# Altium schematic sheet 36. PCIe_M.2_INTERFACE SDIO.SchDoc: PCIe_M.2_INTERFACE (E Key)
size 513 x 386 mm; Project: PROC154E2(001)_SK_AM69; Issue: 1.0; RevCode: E3; Page Create Date: March  8, 1995; Variant Name: Core Design; Schematic Page Number: 36; Page Number: 36; Page Size: C; Comment: MISTRAL_TITLEBLK_CSIZE_1; Page Count: 62; Schematic Page Count: 62; Name: PROC154E2 001 SK AM69; DsnPath: C:\Users\danie\Downloads\sprr466c\PROC154E3_RP\PROC154E3_SCH.DSN; SchematicName: SCHEMATIC1; PageName: 36. PCIe_M.2_INTERFACE SDIO; PageSize: C; TopSchematic: True
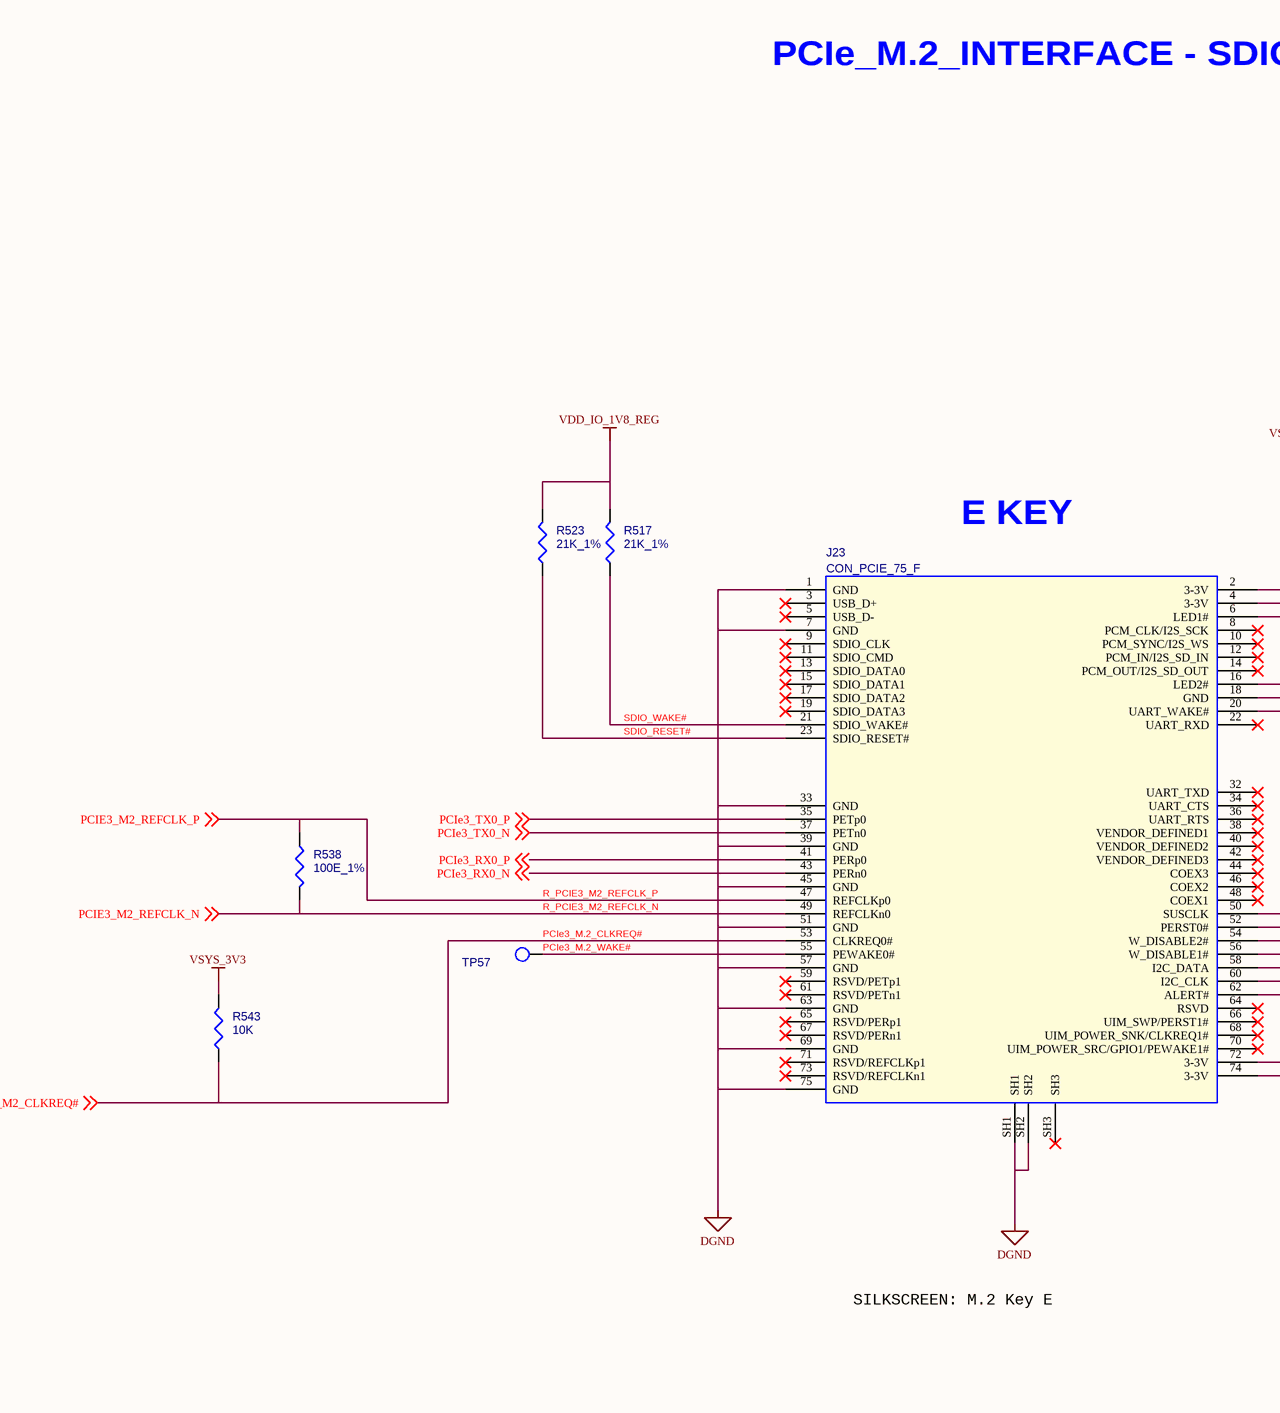
[diagram p0: 36. PCIe_M.2_INTERFACE SDIO.SchDoc, left]
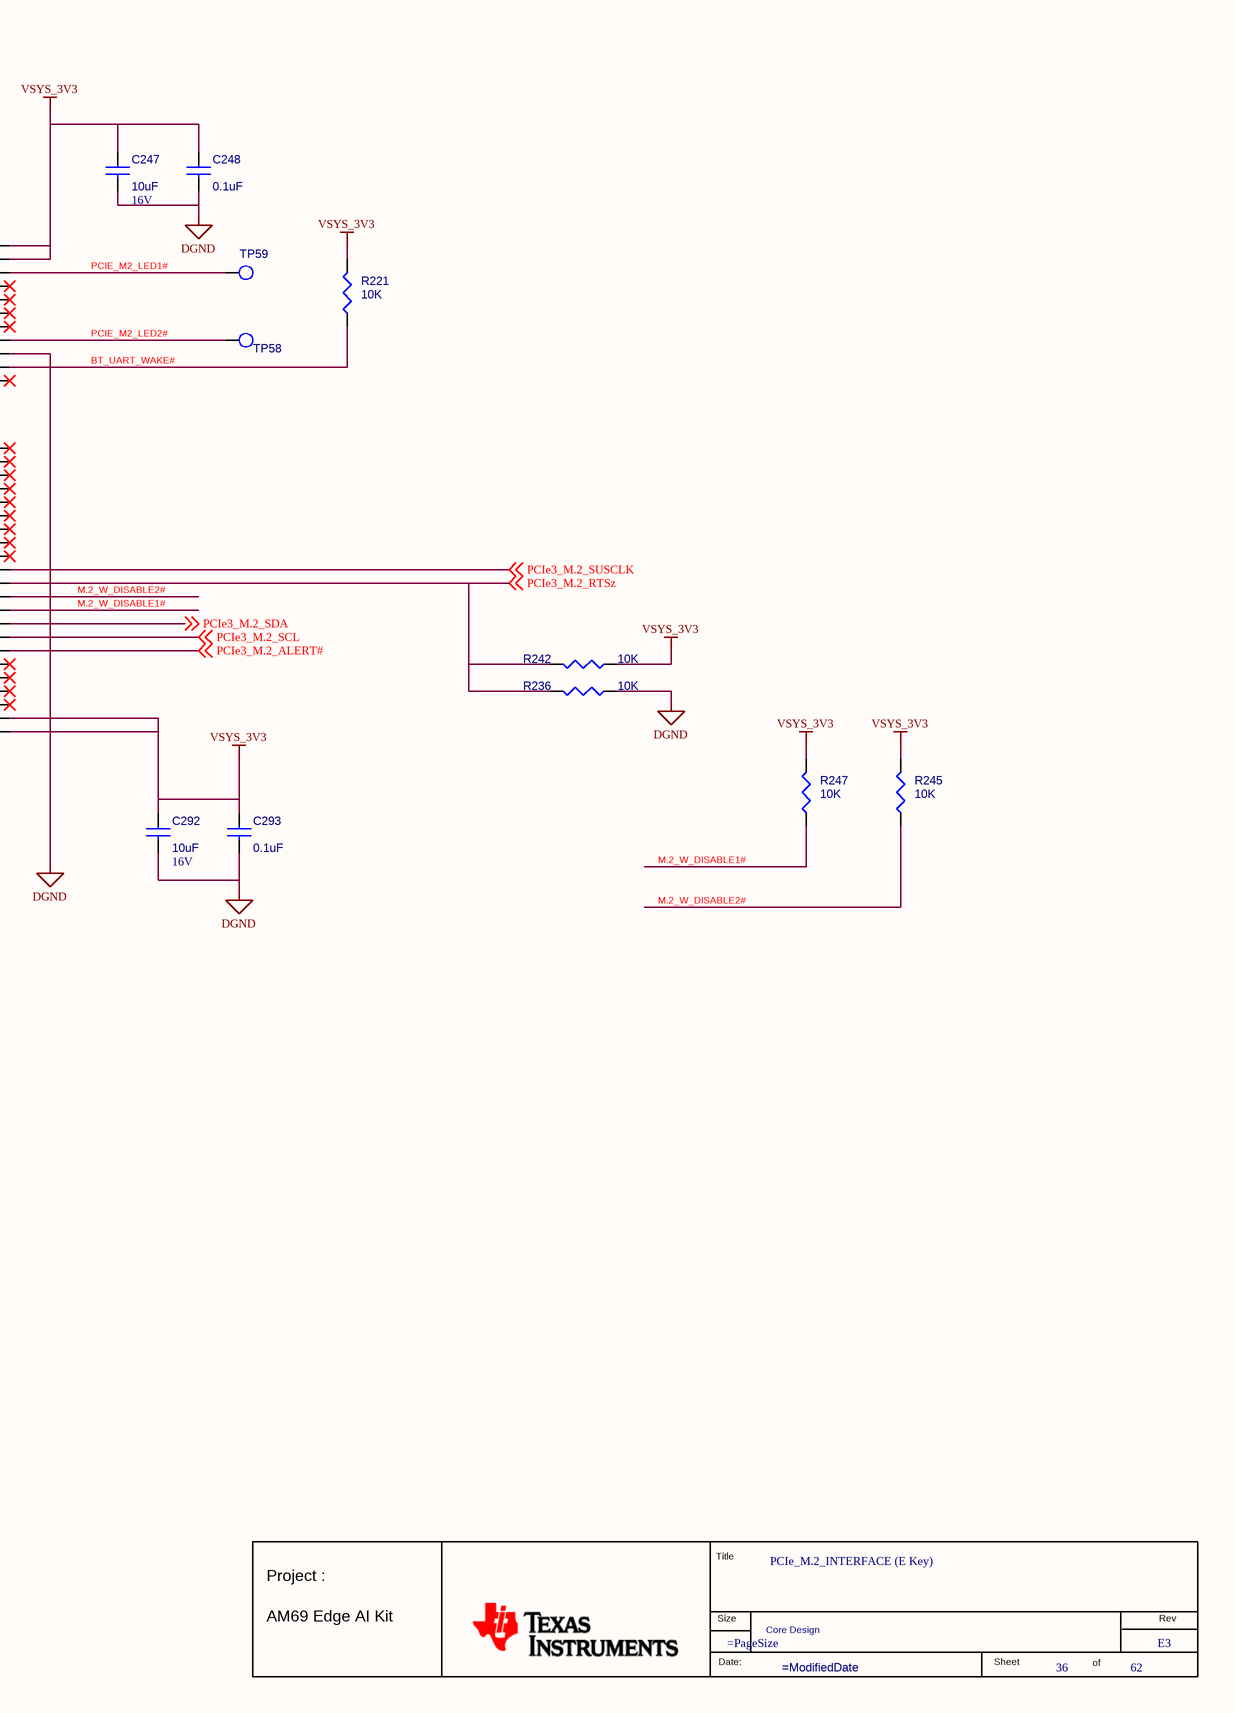
[diagram p1: 36. PCIe_M.2_INTERFACE SDIO.SchDoc, right]

## Parts
*  RevCode: E3  Title: PCIe_M.2_INTERFACE (E Key)  Page Number: 36  Page Count: 62  Variant Name: Core Design  (hidden comment: MISTRAL_TITLEBLK_CSIZE_1)  (graphical)
C247  10uF  Voltage: 16V  [CAP0603_1]
C248  0.1uF  [CAP0201_0-5]
C292  10uF  Voltage: 16V  [CAP0603_1]
C293  0.1uF  [CAP0201_0-5]
J23  CON_PCIE_75_F  [CON_PCIE75_MDT320E01001_S_R_S_3-2_2230]
R221  10K  [RES0201_0-5]
R236  10K  [RES0402_0-5]
R242  10K  [RES0402_0-5]
R245  10K  [RES0201_0-5]
R247  10K  [RES0201_0-5]
R517  21K_1%  [RES0201_0-5]
R523  21K_1%  [RES0201_0-5]
R538  100E_1%  [RES0402_0-5]
R543  10K  [RES0201_0-5]
TP57  TP30_SMD  [TP30_SMD]  (value not drawn)
TP58  TP30_SMD  [TP30_SMD]  (value not drawn)
TP59  TP30_SMD  [TP30_SMD]  (value not drawn)

## Nets
DGND: C247.2 C248.2 C292.2 C293.2 J23.1(GND) J23.7(GND) J23.18(GND) J23.33(GND) J23.39(GND) J23.45(GND) J23.51(GND) J23.57(GND) J23.63(GND) J23.69(GND) J23.75(GND) J23.SH1 J23.SH2 R236.1
VDD_IO_1V8_REG: R517.2 R523.2
VSYS_3V3: C247.1 C248.1 C292.1 C293.1 J23.2(3-3V) J23.4(3-3V) J23.72(3-3V) J23.74(3-3V) R221.2 R242.1 R245.2 R247.2 R543.2
BT_UART_WAKE#: J23.20(UART_WAKE#) R221.1
M.2_W_DISABLE1#: J23.56(W_DISABLE1#) R247.1
M.2_W_DISABLE2#: J23.54(W_DISABLE2#) R245.1
PCIe3_M.2_ALERT#: J23.62(ALERT#) ; off-sheet PCIe3_M.2_ALERT#
PCIe3_M.2_CLKREQ#: J23.53(CLKREQ0#) R543.1 ; off-sheet PCIe3_M2_CLKREQ#  [also labelled PCIe3_M2_CLKREQ#]
PCIe3_M.2_RTSz: J23.52(PERST0#) R236.2 R242.2 ; off-sheet PCIe3_M.2_RTSz
PCIe3_M.2_SCL: J23.60(I2C_CLK) ; off-sheet PCIe3_M.2_SCL
PCIe3_M.2_SDA: J23.58(I2C_DATA) ; off-sheet PCIe3_M.2_SDA
PCIe3_M.2_SUSCLK: J23.50(SUSCLK) ; off-sheet PCIe3_M.2_SUSCLK
PCIe3_M.2_WAKE#: J23.55(PEWAKE0#) TP57.1(TP)
PCIe3_RX0_N: J23.43(PERn0) ; off-sheet PCIe3_RX0_N
PCIe3_RX0_P: J23.41(PERp0) ; off-sheet PCIe3_RX0_P
PCIe3_TX0_N: J23.37(PETn0) ; off-sheet PCIe3_TX0_N
PCIe3_TX0_P: J23.35(PETp0) ; off-sheet PCIe3_TX0_P
PCIE_M2_LED1#: J23.6(LED1#) TP59.1(TP)
PCIE_M2_LED2#: J23.16(LED2#) TP58.1(TP)
R_PCIE3_M2_REFCLK_N: J23.49(REFCLKn0) R538.1 ; off-sheet PCIE3_M2_REFCLK_N  [also labelled PCIE3_M2_REFCLK_N]
R_PCIE3_M2_REFCLK_P: J23.47(REFCLKp0) R538.2 ; off-sheet PCIE3_M2_REFCLK_P  [also labelled PCIE3_M2_REFCLK_P]
SDIO_RESET#: J23.23(SDIO_RESET#) R523.1
SDIO_WAKE#: J23.21(SDIO_WAKE#) R517.1

Not connected (* = marked no-connect by the designer): J23 3(USB_D+)* 5(USB_D-)* 8(PCM_CLK/I2S_SCK)* 9(SDIO_CLK)* 10(PCM_SYNC/I2S_WS)* 11(SDIO_CMD)* 12(PCM_IN/I2S_SD_IN)* 13(SDIO_DATA0)* 14(PCM_OUT/I2S_SD_OUT)* 15(SDIO_DATA1)* 17(SDIO_DATA2)* 19(SDIO_DATA3)* 22(UART_RXD)* 32(UART_TXD)* 34(UART_CTS)* 36(UART_RTS)* 38(VENDOR_DEFINED1)* 40(VENDOR_DEFINED2)* 42(VENDOR_DEFINED3)* 44(COEX3)* 46(COEX2)* 48(COEX1)* 59(RSVD/PETp1)* 61(RSVD/PETn1)* 64(RSVD)* 65(RSVD/PERp1)* 66(UIM_SWP/PERST1#)* 67(RSVD/PERn1)* 68(UIM_POWER_SNK/CLKREQ1#)* 70(UIM_POWER_SRC/GPIO1/PEWAKE1#)* 71(RSVD/REFCLKp1)* 73(RSVD/REFCLKn1)* SH3*

## Notes on the sheet
- PCIe_M.2_INTERFACE - SDIO
- E KEY
- SILKSCREEN: M.2 Key E
- (in symbol MISTRAL_TITLEBLK_CSIZE_1) Title; Project :; Size; Rev; AM69 Edge AI Kit; Date:; Sheet; of

## Library data of the parts
* = MISTRAL_TITLEBLK_CSIZE_1: Issue: 1.0; Project: PROC154E2(001)_SK_AM69; Name: PROC154E2 001 SK AM69; Page Create Date: March  8, 1995; Page Size: =PageSize; Page Modify Date: =ModifiedDate; Schematic Page Count: 62; Schematic Page Number: 36
C247 = CAP_Dup1: CAP CERAMIC 10uF 16V 20% X6S AUTO 0603; Part Reference: C247; Part_type: CAPACITORS\CERAMIC; Mfr_part_number: GRT188C81C106ME13D; Mfr_name: MURATA; Mistral Part No: 120020090012-R; Direct Alternate_mfr_name: TDK; Direct Alternate_mfr_part_number: C1608X5R1E106M080AC; Automotive Alternate_mfr_part_number: GRT188R61E106ME13D; Custom_Duty: 15%; Customs_HS_Code: 85322990; Wattage: NA; Project: J7VCL_SOM_LEO_HERA_PMIC_BRD; Value: 10uF; MECHANICAL 3D STEP FILE: CAP0603_1; Chkd/date: MANIRAJA/180920; Crtd /date: ALVY/170920; Datasheet: Y:\MIS_DATABASE\DATASHEETS\CAPACITORS\GRT188C81C106ME13.PDF; Temperature: -55°C+105°C; Weight: 2mg; Height: 1.00MM; Distributor_part_number: 490-12286-1-ND; Distributor_name: DIGIKEY; Package: 0603; Tolerance: 20%; Library Ref: CAP; Footprint Ref: CAP0603_1; Library Path: Y:\MIS_DATABASE\Library\ALTIUM_TOOL\SCHEMATICS_PARTS\MS_DISCRETE_Library.schlib; Footprint Path: Y:\MIS_DATABASE\Library\ALTIUM_TOOL\PCB_FOOTPRINTS\Altium_Footprint_Lib.PcbLib; Automotive Alternate_mfr_name: MURATA; PCB Footprint: CAP0603_1
C248 = CAP_Dup1: CAP CERAMIC 0.1uF 16V 10% X7S AUTO 0201; Part Reference: C248; Part_type: CAPACITORS\CERAMIC; Mfr_part_number: GRT033C71C104KE01D; Mfr_name: MURATA; Mistral Part No: 120021030007-R; Custom_Duty: 15%; Customs_HS_Code: 85322990; Wattage: NA; Project: J7ES_SK_BRD; Value: 0.1uF; MECHANICAL 3D STEP FILE: CAP0201_0-5; Chkd/date: MANIRAJA/110321; Crtd /date: ALVY/110321; Datasheet: Y:\MIS_DATABASE\DATASHEETS\CAPACITORS\GRT033C71C104KE01.PDF; Temperature: -55°C+125°C; Weight: 330mg; Height: 0.33MM; Distributor_part_number: 490-GRT033C71C104KE01DTR-ND; Distributor_name: DIGIKEY; Package: 0201; Voltage: 16V; Tolerance: 10%; PCB Footprint: CAP0201_0-5
C292 = CAP_Dup1: CAP CERAMIC 10uF 16V 20% X6S AUTO 0603; Part Reference: C292; Part_type: CAPACITORS\CERAMIC; Mfr_part_number: GRT188C81C106ME13D; Mfr_name: MURATA; Mistral Part No: 120020090012-R; Direct Alternate_mfr_name: TDK; Direct Alternate_mfr_part_number: C1608X5R1E106M080AC; Automotive Alternate_mfr_part_number: GRT188R61E106ME13D; Custom_Duty: 15%; Customs_HS_Code: 85322990; Wattage: NA; Project: J7VCL_SOM_LEO_HERA_PMIC_BRD; Value: 10uF; MECHANICAL 3D STEP FILE: CAP0603_1; Chkd/date: MANIRAJA/180920; Crtd /date: ALVY/170920; Datasheet: Y:\MIS_DATABASE\DATASHEETS\CAPACITORS\GRT188C81C106ME13.PDF; Temperature: -55°C+105°C; Weight: 2mg; Height: 1.00MM; Distributor_part_number: 490-12286-1-ND; Distributor_name: DIGIKEY; Package: 0603; Tolerance: 20%; Library Ref: CAP; Footprint Ref: CAP0603_1; Library Path: Y:\MIS_DATABASE\Library\ALTIUM_TOOL\SCHEMATICS_PARTS\MS_DISCRETE_Library.schlib; Footprint Path: Y:\MIS_DATABASE\Library\ALTIUM_TOOL\PCB_FOOTPRINTS\Altium_Footprint_Lib.PcbLib; Automotive Alternate_mfr_name: MURATA; PCB Footprint: CAP0603_1
C293 = CAP_Dup1: CAP CERAMIC 0.1uF 16V 10% X7S AUTO 0201; Part Reference: C293; Mistral Part No: 120021030007-R; Mfr_name: MURATA; Mfr_part_number: GRT033C71C104KE01D; Part_type: CAPACITORS\CERAMIC; Project: J7ES_SK_BRD; Wattage: NA; Customs_HS_Code: 85322990; Custom_Duty: 15%; Value: 0.1uF; Tolerance: 10%; Voltage: 16V; Package: 0201; Distributor_name: DIGIKEY; Distributor_part_number: 490-GRT033C71C104KE01DTR-ND; Height: 0.33MM; Weight: 330mg; Temperature: -55°C+125°C; Datasheet: Y:\MIS_DATABASE\DATASHEETS\CAPACITORS\GRT033C71C104KE01.PDF; Crtd /date: ALVY/110321; Chkd/date: MANIRAJA/110321; MECHANICAL 3D STEP FILE: CAP0201_0-5; PCB Footprint: CAP0201_0-5
J23 = CON_PCI_75_MDT320E01001_2230: CON PCI EXPRESS 75POS 0.50MM PITCH FEMALE RT SMD; Part Reference: J23; Part_type: CONNECTOR\PCI; Mfr_name: AMPHENOL; Mistral Part No: 150021020005-R; Custom_Duty: 24%; Customs_HS_Code: 85369090; Wattage: NA; Project: J7ES_SK_BRD; Value: CON_PCIE_75_F; Footprint Path: Y:\MIS_DATABASE\Library\ALTIUM_TOOL\PCB_FOOTPRINTS\Altium_Footprint_Lib.PcbLib; Library Path: Y:\MIS_DATABASE\Library\ALTIUM_TOOL\SCHEMATICS_PARTS\MS_CONNECTOR_Library.schlib; MECHANICAL 3D STEP FILE: CON_PCIE75_MDT320E01001_S_R_S_3-2_2230; Chkd/date: ALVY/040221; Crtd /date: MANIRAJA/030221; Datasheet: Y:\MIS_DATABASE\DATASHEETS\CONNECTORS\MDTXXXX001.PDF; Temperature: -40°C+80°C; Weight: NA; Height: 3.20MM; Library Ref: CON_PCI_75_MDT320E01001_2230; Distributor_part_number: MDT320E01001CT-ND; Distributor_name: DIGIKEY; Package: SMD; Voltage: NA; Tolerance: NA; Mfr_part_number: MDT320E01001_2230; Footprint Ref: CON_PCIE75_MDT320E01001_S_R_S_3-2_2230; PCB Footprint: CON_PCIE75_MDT320E01001_S_R_S_3-2_2230
R221 = RESISTOR_Dup2: RES 10K 1/20W 5% 0201; Part Reference: R221; Part_type: RESISTORS\FIXED; Mfr_part_number: RC0201JR-0710KL; Mfr_name: YAGEO AMERICA; Mistral Part No: 110010070051-R; Custom_Duty: 15%; Customs_HS_Code: 85332119; Voltage: NA; Project: GOLDEN-I LITE; Value: 10K; MECHANICAL 3D STEP FILE: RES0201_0-5; Chkd/date: MANIRAJA/050517; Crtd /date: MANIRAJA/050517; Datasheet: Y:\MIS_DATABASE\DATASHEETS\RESISTORS\RCXXXXL-SER_MAR18.PDF; Temperature: -55°C+125°C; Weight: 0.17mg; Height: 0.26MM; Distributor_part_number: 311-10KNCT-ND; Distributor_name: DIGIKEY; Package: 0201; Wattage: 1/20W; Tolerance: 5%; Library Ref: RESISTOR; Footprint Ref: RES0201_0-5; Library Path: Y:\MIS_DATABASE\Library\ALTIUM_TOOL\SCHEMATICS_PARTS\MS_DISCRETE_Library.schlib; Footprint Path: Y:\MIS_DATABASE\Library\ALTIUM_TOOL\PCB_FOOTPRINTS\Altium_Footprint_Lib.PcbLib; PCB Footprint: RES0201_0-5
R236 = RESISTOR_Dup2: RES 10K 1/16W 5% 0402; Part Reference: R236; Part_type: RESISTORS\FIXED; Mfr_part_number: RC0402JR-0710KL; Mfr_name: YAGEO AMERICA; Mistral Part No: 110011060021-R; Custom_Duty: 15%; Customs_HS_Code: 85332119; Voltage: NA; Project: HSE; Value: 10K; MECHANICAL 3D STEP FILE: RES0402_0-5; Chkd/date: VASANTHA/061216; Crtd /date: MAZHAR/230805; Datasheet: Y:\MIS_DATABASE\DATASHEETS\RESISTORS\RCXXXXL-SER_MAR18.PDF; Temperature: -55°C+155°C; Weight: 0.65mg; Height: 0.40MM; Distributor_part_number: 311-10KJRCT-ND; Distributor_name: DIGIKEY; Package: 0402; Wattage: 1/16W; Tolerance: 5%; Library Ref: RESISTOR; Footprint Ref: RES0402_0-5; Library Path: Y:\MIS_DATABASE\Library\ALTIUM_TOOL\SCHEMATICS_PARTS\MS_DISCRETE_Library.schlib; Footprint Path: Y:\MIS_DATABASE\Library\ALTIUM_TOOL\PCB_FOOTPRINTS\Altium_Footprint_Lib.PcbLib; PCB Footprint: RES0402_0-5
R242 = RESISTOR_Dup2: RES 10K 1/16W 5% 0402; Part Reference: R242; Part_type: RESISTORS\FIXED; Mfr_part_number: RC0402JR-0710KL; Mfr_name: YAGEO AMERICA; Mistral Part No: 110011060021-R; Custom_Duty: 15%; Customs_HS_Code: 85332119; Voltage: NA; Project: HSE; Value: 10K; MECHANICAL 3D STEP FILE: RES0402_0-5; Chkd/date: VASANTHA/061216; Crtd /date: MAZHAR/230805; Datasheet: Y:\MIS_DATABASE\DATASHEETS\RESISTORS\RCXXXXL-SER_MAR18.PDF; Temperature: -55°C+155°C; Weight: 0.65mg; Height: 0.40MM; Distributor_part_number: 311-10KJRCT-ND; Distributor_name: DIGIKEY; Package: 0402; Wattage: 1/16W; Tolerance: 5%; Library Ref: RESISTOR; Footprint Ref: RES0402_0-5; Library Path: Y:\MIS_DATABASE\Library\ALTIUM_TOOL\SCHEMATICS_PARTS\MS_DISCRETE_Library.schlib; Footprint Path: Y:\MIS_DATABASE\Library\ALTIUM_TOOL\PCB_FOOTPRINTS\Altium_Footprint_Lib.PcbLib; PCB Footprint: RES0402_0-5
R245 = RESISTOR_Dup2: RES 10K 1/20W 5% 0201; Part Reference: R245; Part_type: RESISTORS\FIXED; Mfr_part_number: RC0201JR-0710KL; Mfr_name: YAGEO AMERICA; Mistral Part No: 110010070051-R; Custom_Duty: 15%; Customs_HS_Code: 85332119; Voltage: NA; Project: GOLDEN-I LITE; Value: 10K; MECHANICAL 3D STEP FILE: RES0201_0-5; Chkd/date: MANIRAJA/050517; Crtd /date: MANIRAJA/050517; Datasheet: Y:\MIS_DATABASE\DATASHEETS\RESISTORS\RCXXXXL-SER_MAR18.PDF; Temperature: -55°C+125°C; Weight: 0.17mg; Height: 0.26MM; Distributor_part_number: 311-10KNCT-ND; Distributor_name: DIGIKEY; Package: 0201; Wattage: 1/20W; Tolerance: 5%; Library Ref: RESISTOR; Footprint Ref: RES0201_0-5; Library Path: Y:\MIS_DATABASE\Library\ALTIUM_TOOL\SCHEMATICS_PARTS\MS_DISCRETE_Library.schlib; Footprint Path: Y:\MIS_DATABASE\Library\ALTIUM_TOOL\PCB_FOOTPRINTS\Altium_Footprint_Lib.PcbLib; PCB Footprint: RES0201_0-5
R247 = RESISTOR_Dup2: RES 10K 1/20W 5% 0201; Part Reference: R247; Part_type: RESISTORS\FIXED; Mfr_part_number: RC0201JR-0710KL; Mfr_name: YAGEO AMERICA; Mistral Part No: 110010070051-R; Custom_Duty: 15%; Customs_HS_Code: 85332119; Voltage: NA; Project: GOLDEN-I LITE; Value: 10K; MECHANICAL 3D STEP FILE: RES0201_0-5; Chkd/date: MANIRAJA/050517; Crtd /date: MANIRAJA/050517; Datasheet: Y:\MIS_DATABASE\DATASHEETS\RESISTORS\RCXXXXL-SER_MAR18.PDF; Temperature: -55°C+125°C; Weight: 0.17mg; Height: 0.26MM; Distributor_part_number: 311-10KNCT-ND; Distributor_name: DIGIKEY; Package: 0201; Wattage: 1/20W; Tolerance: 5%; Library Ref: RESISTOR; Footprint Ref: RES0201_0-5; Library Path: Y:\MIS_DATABASE\Library\ALTIUM_TOOL\SCHEMATICS_PARTS\MS_DISCRETE_Library.schlib; Footprint Path: Y:\MIS_DATABASE\Library\ALTIUM_TOOL\PCB_FOOTPRINTS\Altium_Footprint_Lib.PcbLib; PCB Footprint: RES0201_0-5
R517 = RESISTOR_Dup2: RES 21K 1/20W 1% 0201; Part Reference: R517; Part_type: RESISTORS\FIXED; Mfr_part_number: RC0201FR-0721KL; Mfr_name: YAGEO AMERICA; Mistral Part No: 110016110009-R; Custom_Duty: 15%; Customs_HS_Code: 85332119; Voltage: NA; Project: GOLDEN-I LITE; Value: 21K_1%; MECHANICAL 3D STEP FILE: RES0201_0-5; Chkd/date: MANIRAJA/030717; Crtd /date: MANIRAJA/030717; Datasheet: Y:\MIS_DATABASE\DATASHEETS\RESISTORS\RCXXXXL-SER_MAR18.PDF; Temperature: -55°C+125°C; Weight: 0.17mg; Height: 0.26MM; Distributor_part_number: YAG2506CT-ND; Distributor_name: DIGIKEY; Package: 0201; Wattage: 1/20W; Tolerance: 1%; Library Ref: RESISTOR; Footprint Ref: RES0201_0-5; Library Path: Y:\MIS_DATABASE\Library\ALTIUM_TOOL\SCHEMATICS_PARTS\MS_DISCRETE_Library.schlib; Footprint Path: Y:\MIS_DATABASE\Library\ALTIUM_TOOL\PCB_FOOTPRINTS\Altium_Footprint_Lib.PcbLib; PCB Footprint: RES0201_0-5
R523 = RESISTOR_Dup2: RES 21K 1/20W 1% 0201; Part Reference: R523; Mistral Part No: 110016110009-R; Mfr_name: YAGEO AMERICA; Mfr_part_number: RC0201FR-0721KL; Part_type: RESISTORS\FIXED; Project: GOLDEN-I LITE; Voltage: NA; Customs_HS_Code: 85332119; Custom_Duty: 15%; Value: 21K_1%; PCB Footprint: RES0201_0-5; Footprint Path: Y:\MIS_DATABASE\Library\ALTIUM_TOOL\PCB_FOOTPRINTS\Altium_Footprint_Lib.PcbLib; Library Path: Y:\MIS_DATABASE\Library\ALTIUM_TOOL\SCHEMATICS_PARTS\MS_DISCRETE_Library.schlib; Footprint Ref: RES0201_0-5; Library Ref: RESISTOR; Tolerance: 1%; Wattage: 1/20W; Package: 0201; Distributor_name: DIGIKEY; Distributor_part_number: YAG2506CT-ND; Height: 0.26MM; Weight: 0.17mg; Temperature: -55°C+125°C; Datasheet: Y:\MIS_DATABASE\DATASHEETS\RESISTORS\RCXXXXL-SER_MAR18.PDF; Crtd /date: MANIRAJA/030717; Chkd/date: MANIRAJA/030717; MECHANICAL 3D STEP FILE: RES0201_0-5
R538 = RESISTOR_Dup2: RES 100E 1/10W 1% 0402; Part Reference: R538; Part_type: RESISTORS\FIXED; Mfr_part_number: ERJ-2RKF1000X; Mfr_name: PANASONIC-ECG; Mistral Part No: 110018020036-R; Custom_Duty: 15%; Customs_HS_Code: 85332119; Voltage: NA; Project: CYPHY_FVB; Value: 100E_1%; Footprint Path: Y:\MIS_DATABASE\Library\ALTIUM_TOOL\PCB_FOOTPRINTS\Altium_Footprint_Lib.PcbLib; Library Path: Y:\MIS_DATABASE\Library\ALTIUM_TOOL\SCHEMATICS_PARTS\MS_DISCRETE_Library.schlib; Footprint Ref: RES0402_0-5; Library Ref: RESISTOR; Chkd/date: MANIRAJA/130617; Crtd /date: JEBRAN/040715; Datasheet: Y:\MIS_DATABASE\DATASHEETS\RESISTORS\PAN-ERJSER_NOV17.PDF; Temperature: -55°C+155°C; Weight: 0.8mg; Height: 0.40MM; Distributor_part_number: P100LCT-ND; Distributor_name: DIGIKEY; Package: 0402; Wattage: 1/10W; Tolerance: 1%; MECHANICAL 3D STEP FILE: RES0402_0-5; PCB Footprint: RES0402_0-5
R543 = RESISTOR_Dup2: RES 10K 1/20W 5% 0201; Part Reference: R543; Part_type: RESISTORS\FIXED; Mfr_part_number: RC0201JR-0710KL; Mfr_name: YAGEO AMERICA; Mistral Part No: 110010070051-R; Custom_Duty: 15%; Customs_HS_Code: 85332119; Voltage: NA; Project: GOLDEN-I LITE; Value: 10K; MECHANICAL 3D STEP FILE: RES0201_0-5; Chkd/date: MANIRAJA/050517; Crtd /date: MANIRAJA/050517; Datasheet: Y:\MIS_DATABASE\DATASHEETS\RESISTORS\RCXXXXL-SER_MAR18.PDF; Temperature: -55°C+125°C; Weight: 0.17mg; Height: 0.26MM; Distributor_part_number: 311-10KNCT-ND; Distributor_name: DIGIKEY; Package: 0201; Wattage: 1/20W; Tolerance: 5%; Library Ref: RESISTOR; Footprint Ref: RES0201_0-5; Library Path: Y:\MIS_DATABASE\Library\ALTIUM_TOOL\SCHEMATICS_PARTS\MS_DISCRETE_Library.schlib; Footprint Path: Y:\MIS_DATABASE\Library\ALTIUM_TOOL\PCB_FOOTPRINTS\Altium_Footprint_Lib.PcbLib; PCB Footprint: RES0201_0-5
TP57 = TESTPOINT_Dup1: TESTPOINT CIR 30 SMD; Part Reference: TP57; Mfr_name: LOCAL; Mistral Part No: 130009030930; MECHANICAL 3D STEP FILE: NA; Project: BT MODULE_CSRBC04; Value: TP30_SMD; PCB Footprint: TP30_SMD; Footprint Path: Y:\MIS_DATABASE\Library\ALTIUM_TOOL\PCB_FOOTPRINTS\Altium_Footprint_Lib.PcbLib; Library Path: Y:\MIS_DATABASE\Library\ALTIUM_TOOL\SCHEMATICS_PARTS\MS_DISCRETE_Library.schlib; Custom_Duty: NA; Customs_HS_Code: NA; RoHS: NA; Temperature: NA; Weight: NA; Wattage: NA; Voltage: NA; Tolerance: NA; Footprint Ref: TP30_SMD; Datasheet: NA; Chkd/date: SHREESHAIL/171006; Crtd /date: MAZHAR/171006; Height: NA; Distributor_part_number: NA; Distributor_name: NA; Package: SMD; Part_type: TESTPOINT; Mfr_part_number: TP30_SMD; Library Ref: TESTPOINT
TP58 = TESTPOINT_Dup1: TESTPOINT CIR 30 SMD; Part Reference: TP58; Mfr_name: LOCAL; Mistral Part No: 130009030930; MECHANICAL 3D STEP FILE: NA; Project: BT MODULE_CSRBC04; Value: TP30_SMD; Footprint Path: Y:\MIS_DATABASE\Library\ALTIUM_TOOL\PCB_FOOTPRINTS\Altium_Footprint_Lib.PcbLib; Library Path: Y:\MIS_DATABASE\Library\ALTIUM_TOOL\SCHEMATICS_PARTS\MS_DISCRETE_Library.schlib; Custom_Duty: NA; Customs_HS_Code: NA; RoHS: NA; Temperature: NA; Weight: NA; Wattage: NA; Voltage: NA; Tolerance: NA; Footprint Ref: TP30_SMD; Datasheet: NA; Chkd/date: SHREESHAIL/171006; Crtd /date: MAZHAR/171006; Height: NA; Distributor_part_number: NA; Distributor_name: NA; Package: SMD; Part_type: TESTPOINT; Mfr_part_number: TP30_SMD; Library Ref: TESTPOINT; PCB Footprint: TP30_SMD
TP59 = TESTPOINT_Dup1: TESTPOINT CIR 30 SMD; Part Reference: TP59; Mistral Part No: 130009030930; Mfr_name: LOCAL; Project: BT MODULE_CSRBC04; Tolerance: NA; Value: TP30_SMD; Library Ref: TESTPOINT; Mfr_part_number: TP30_SMD; Part_type: TESTPOINT; Package: SMD; Distributor_name: NA; Distributor_part_number: NA; Height: NA; Crtd /date: MAZHAR/171006; Chkd/date: SHREESHAIL/171006; Datasheet: NA; Footprint Ref: TP30_SMD; Voltage: NA; Wattage: NA; Weight: NA; Temperature: NA; RoHS: NA; Customs_HS_Code: NA; Custom_Duty: NA; MECHANICAL 3D STEP FILE: NA; Library Path: Y:\MIS_DATABASE\Library\ALTIUM_TOOL\SCHEMATICS_PARTS\MS_DISCRETE_Library.schlib; Footprint Path: Y:\MIS_DATABASE\Library\ALTIUM_TOOL\PCB_FOOTPRINTS\Altium_Footprint_Lib.PcbLib; PCB Footprint: TP30_SMD